# Altium schematic sheet DRV8432SchDoc.SchDoc
size A; SheetNumber: 2; SheetTotal: 4
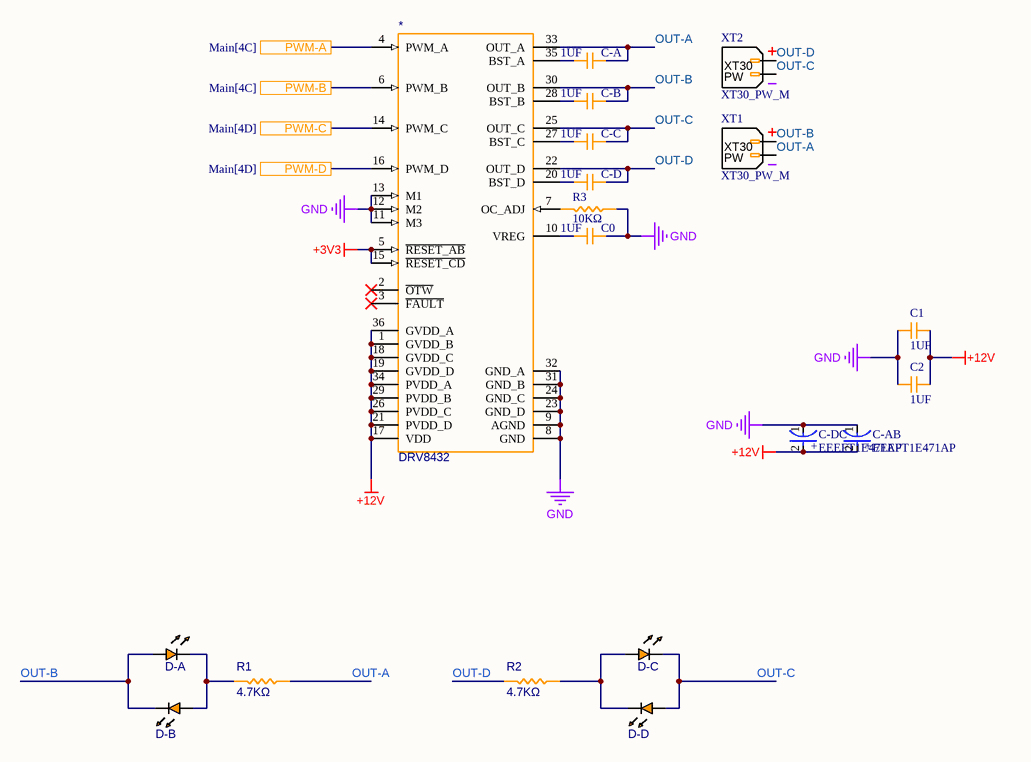
[diagram p0: DRV8432SchDoc.SchDoc]

## Parts
*  DRV8432  [DRV8432]
C0  1UF  [CAP_0603]
C1  1UF  [CAP_0603]
C2  1UF  [CAP_0603]
C-A  1UF  [CAP_0603]
C-AB  EEEFT1E471AP  [FP-FTF-MFG]
C-B  1UF  [CAP_0603]
C-C  1UF  [CAP_0603]
C-D  1UF  [CAP_0603]
C-DC  EEEFT1E471AP  [FP-FTF-MFG]
D-A  LED_0603  [LED_0603]  (value not drawn)
D-B  LED_0603  [LED_0603]  (value not drawn)
D-C  LED_0603  [LED_0603]  (value not drawn)
D-D  LED_0603  [LED_0603]  (value not drawn)
R1  4.7KΩ  [RES_0603]
R2  4.7KΩ  [RES_0603]
R3  10KΩ  [RES_0603]
XT1  XT30_PW_M  [XT30_PW_M]
XT2  XT30_PW_M  [XT30_PW_M]

## Ports
PWM-A (see Main[4C]), PWM-B (see Main[4C]), PWM-C (see Main[4D]), PWM-D (see Main[4D])

## Nets
+3V3: *.5(~{RESET_AB}) *.15(~{RESET_CD})
+12V: *.1(GVDD_B) *.17(VDD) *.18(GVDD_C) *.19(GVDD_D) *.21(PVDD_D) *.26(PVDD_C) *.29(PVDD_B) *.34(PVDD_A) *.36(GVDD_A) C1.2 C2.2 C-AB.2(A) C-DC.2(A)
GND: *.8(GND) *.9(AGND) *.11(M3) *.12(M2) *.13(M1) *.23(GND_D) *.24(GND_C) *.31(GND_B) *.32(GND_A) C0.2 C1.1 C2.1 C-AB.1(C) C-DC.1(C) R3.2
OUT-A: *.33(OUT_A) C-A.2 R1.2 XT1.N
OUT-B: *.30(OUT_B) C-B.2 D-A.A D-B.C XT1.P
OUT-C: *.25(OUT_C) C-C.2 D-C.C D-D.A XT2.N
OUT-D: *.22(OUT_D) C-D.2 R2.1 XT2.P
PWM-A: *.4(PWM_A) ; port PWM-A
PWM-B: *.6(PWM_B) ; port PWM-B
PWM-C: *.14(PWM_C) ; port PWM-C
PWM-D: *.16(PWM_D) ; port PWM-D
Net*_7: *.7(OC_ADJ) R3.1
Net*_10: *.10(VREG) C0.1
Net*_20: *.20(BST_D) C-D.1
Net*_27: *.27(BST_C) C-C.1
Net*_28: *.28(BST_B) C-B.1
Net*_35: *.35(BST_A) C-A.1
NetD-A_C: D-A.C D-B.A R1.1
NetD-C_A: D-C.A D-D.C R2.2

Not connected (* = marked no-connect by the designer): * 2(~{OTW})* 3(~{FAULT})*

## Notes on the sheet
- (in symbol CMP-05427-000040-1) +
- (in symbol XT30_PW_M) XT30; PW

## Library data of the parts
C0-C2 C-A C-B C-C C-D = CAP_0603: Capacitor SMD 0603 generic
C-AB C-DC = CMP-05427-000040-1: CAP ALUM 470UF 20% 25V SMD; ESR (Equivalent Series Resistance): 80mR; Dielectric Material: Aluminium; Lead Diameter: 0.9mm; Ripple Current: 850mA; Leakage Current: 117.5uA; Life (Hours): 2000Hour; Lead Free: Lead Free; Height - Seated (Max): 0.413inch; Contact Plating: Tin; Voltage: 25V; Package Quantity: 500; REACH SVHC: No SVHC; Diameter: 8mm; Features: General Purpose; Voltage Rating: 25V; Radiation Hardening: No; Number of Pins: 2; Length: 10.2mm; Max Operating Temperature: 105°C; Tolerance: 20%; Lead Pitch: 3.1mm; Voltage Rating (DC): 25V; Packaging: Tape and Reel; RoHS Compliant: Yes; Series: FT; Height: 10.2mm; Capacitance: 470uF; Construction: Cylindrical; Case/Package: Radial; Mount: Surface Mount; Termination: SMD/SMT; Min Operating Temperature: -55°C; Ripple Current (AC): 850mA
R1-R3 = RES_0603: Resistor SMD 0603 generic